# Altium schematic sheet Table_of_Contents.SchDoc: SPEX - INTERFACE - ToC
size A4; Author: Derek Belsky; Revision: 0; SheetNumber: 1; SheetTotal: 6
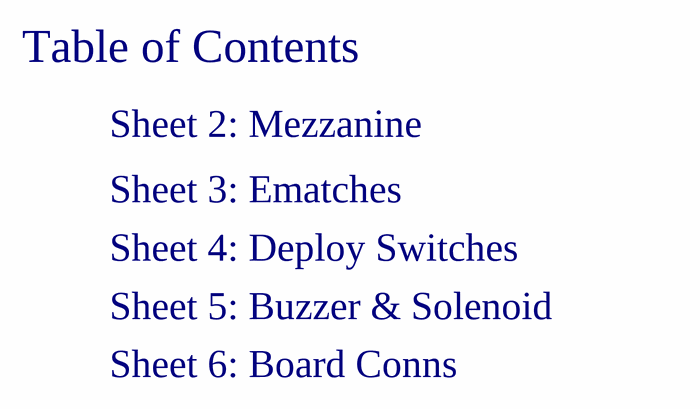
[diagram p0: Table_of_Contents.SchDoc]

## Notes on the sheet
- Table of Contents
- Sheet 2: Mezzanine
- Sheet 3: Ematches
- Sheet 4: Deploy Switches
- Sheet 5: Buzzer & Solenoid
- Sheet 6: Board Conns
- Title
- Size:
- Date:
- A4
- Author:
- Time:
- Sheet
- Revision:
- of
- RIT Space Exploration Team
- Rochester Institute of Technology
- 1 Lomb Memorial Drive
- Rochester, NY 14623
- https://spex.rit.edu
- File: